# EAGLE schematic diagnostic_tool (EAGLE 6.6.0)
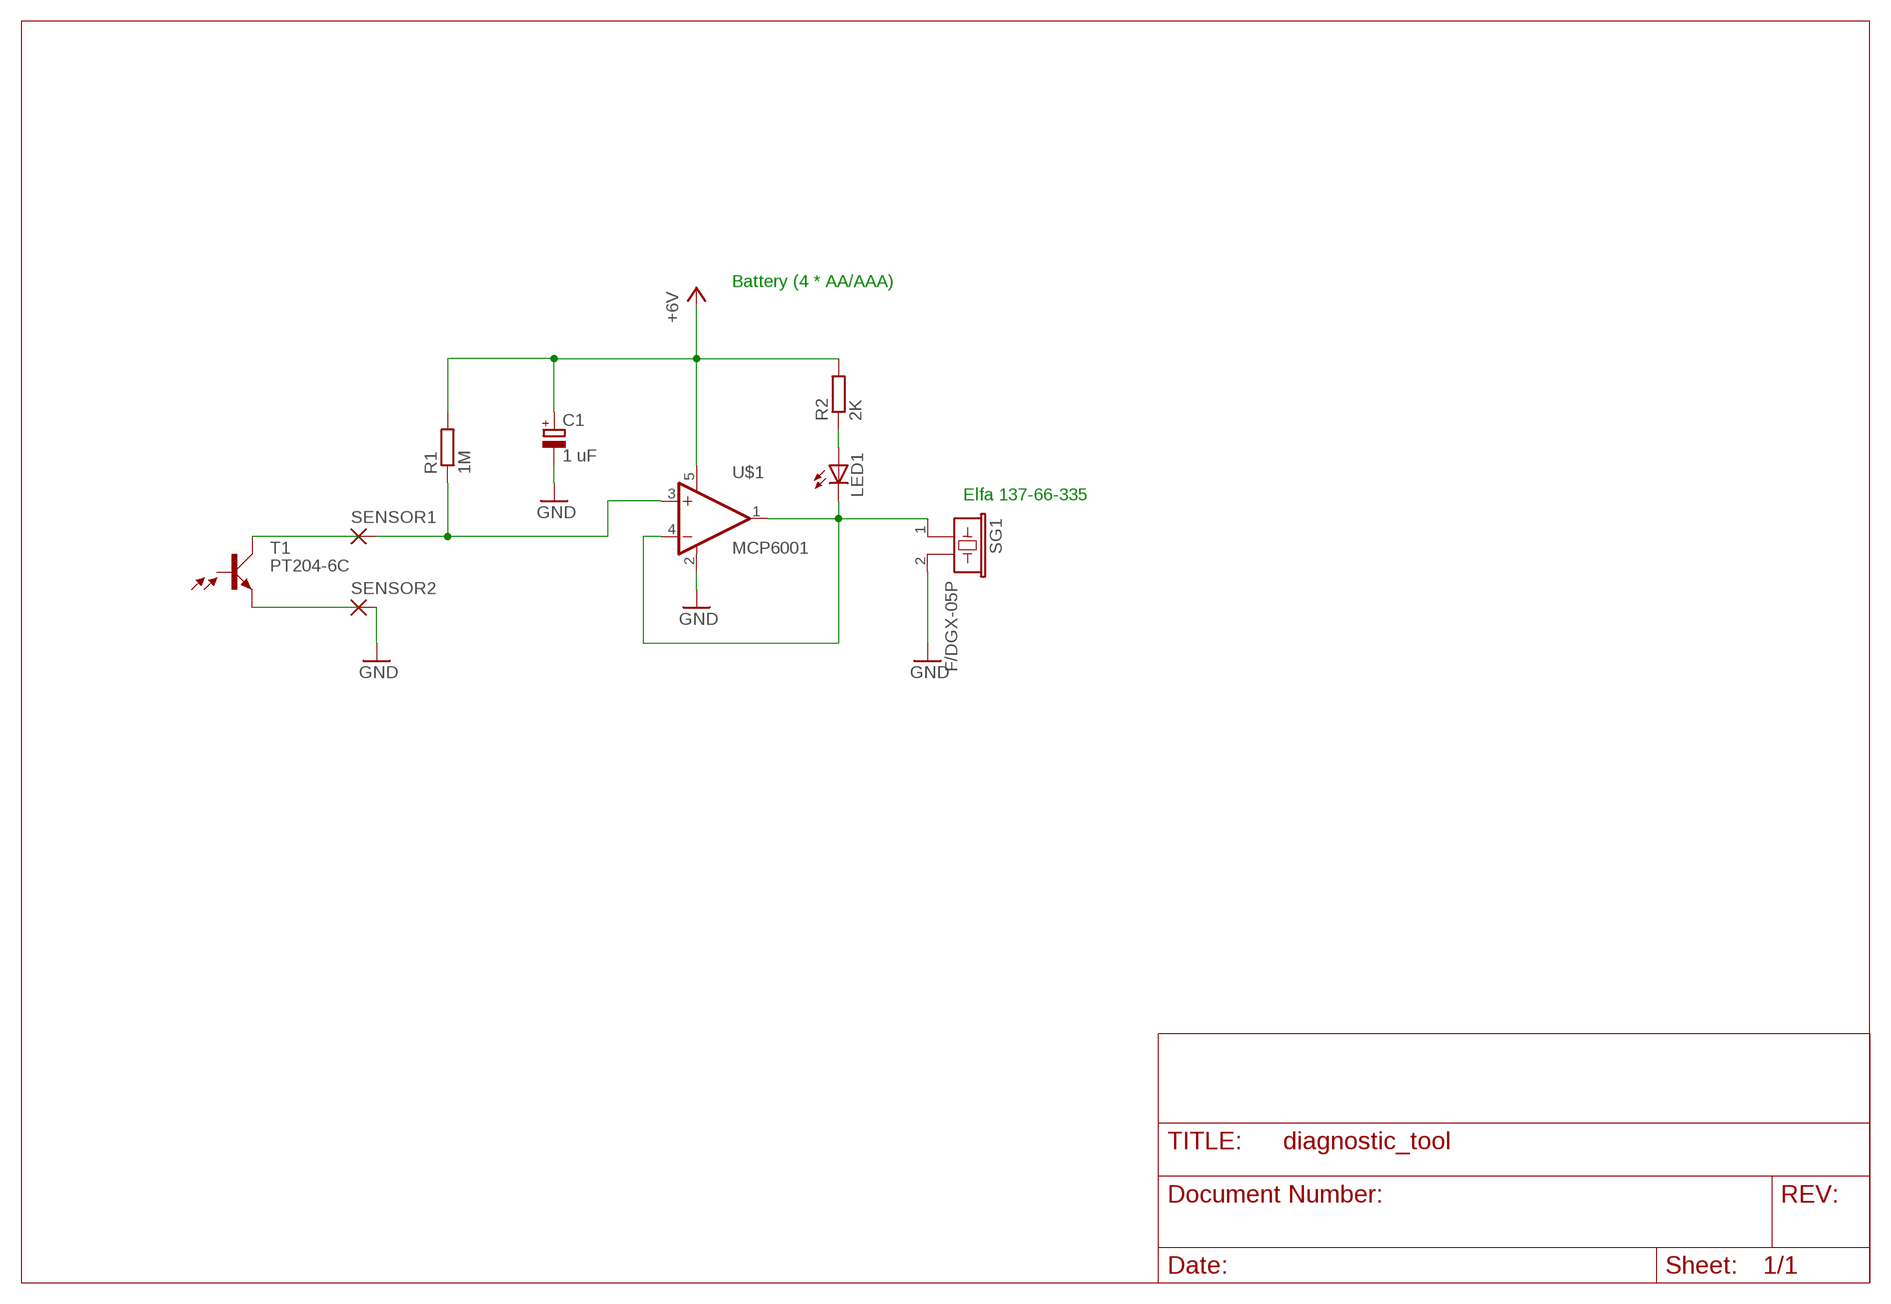
[diagram p0: schematic, sheet 1]

## Parts
C1  1 uF  CPOL-EUE2.5-5  [E2,5-5]
LED1  LED  [SMARTLED-TTW]
R1  1M  R-EU_0207/10  [0207/10]
R2  2K  R-EU_0207/10  [0207/10]
SENSOR1  WIREPAD1,6/0,8  [1,6/0,8]
SENSOR2  WIREPAD1,6/0,8  [1,6/0,8]
SG1  F/DGX-05P  B/C11L  [B/C11L]
T1  PT204-6C  BP103  [BP103]
U$1  MCP6001  [SOT23-5L]

## Nets
+5V: C1.+ R1.2 R2.2 U$1.5(V+) ; supply symbol labelled +6V
GND: C1.- SENSOR2.1(P) SG1.2 U$1.2(V-)
N$1: T1.C
N$2: LED1.A@1(A) R2.1
N$3: LED1.C@1(C) SG1.1 U$1.1(OUT) U$1.4(-IN)
N$4: T1.E
N$5: R1.1 SENSOR1.1(P) U$1.3(+IN)
Unconnected: T1.B

## Notes on the sheet
- Battery (4 * AA/AAA)
- Elfa 137-66-335

## Library data of the parts
C1 = rcl:CPOL-EU: POLARIZED CAPACITOR, European symbol
LED1 = led:LED: LED OSRAM: - CHIPLED LG R971, LG N971, LY N971, LG Q971, LY Q971, LO R971, LY R971 LH N974, LH R974 LS Q976, LO Q976, LY Q976 LO Q996 - Hyper CHIPLED LW Q18S LB Q993, LB Q99A, LB R99A - SideLED LS A670, LO A670, LY A670, LG A670, LP A670 LB A673, LV A673, LT A673, LW A673 LH A674 LY A675 LS A676, LA A676, LO A676, LY A676, LW A676 LS A679, LY A679, LG A679 - Hyper Micro SIDELED® LS Y876, LA Y876, LO Y876, LY Y876 LT Y87S - SmartLED LW L88C, LW L88S LB L89C, LB L89S, LG L890 LS L89K, LO L89K, LY L89K LS L896, LA L896, LO L896, LY L896 - TOPLED LS T670, LO T670, LY T670, LG T670, LP T670 LSG T670, LSP T670, LSY T670, LOP T670, LYG T670 LG T671, LOG T671, LSG T671 LB T673, LV T673, LT T673, LW T673 LH T674 LS T676, LA T676, LO T676, LY T676, LB T676, LH T676, LSB T676, LW T676 LB T67C, LV T67C, LT T67C, LS T67K, LO T67K, LY T67K, LW E67C LS E67B, LA E67B, LO E67B, LY E67B, LB E67C, LV E67C, LT E67C LW T67C LS T679, LY T679, LG T679 LS T770, LO T770, LY T770, LG T770, LP T770 LB T773, LV T773, LT T773, LW T773 LH T774 LS E675, LA E675, LY E675, LS T675 LS T776, LA T776, LO T776, LY T776, LB T776 LHGB T686 LT T68C, LB T68C - Hyper Mini TOPLED® LB M676 - Mini TOPLED Santana® LG M470 LS M47K, LO M47K, LY M47K Source: http://www.osram.convergy.de LUXEON: - LUMILED® LXK2-PW12-R00, LXK2-PW12-S00, LXK2-PW14-U00, LXK2-PW14-V00 LXK2-PM12-R00, LXK2-PM12-S00, LXK2-PM14-U00 LXK2-PE12-Q00, LXK2-PE12-R00, LXK2-PE12-S00, LXK2-PE14-T00, LXK2-PE14-U00 LXK2-PB12-K00, LXK2-PB12-L00, LXK2-PB12-M00, LXK2-PB14-N00, LXK2-PB14-P00, LXK2-PB14-Q00 LXK2-PR12-L00, LXK2-PR12-M00, LXK2-PR14-Q00, LXK2-PR14-R00 LXK2-PD12-Q00, LXK2-PD12-R00, LXK2-PD12-S00 LXK2-PH12-R00, LXK2-PH12-S00 LXK2-PL12-P00, LXK2-PL12-Q00, LXK2-PL12-R00 Source: www.luxeon.com KINGBRIGHT: KA-3528ASYC Source: www.kingbright.com
R1 R2 = rcl:R-EU_: RESISTOR, European symbol
SENSOR1 SENSOR2 = wirepad:WIREPAD: Wire PAD connect wire on PCB
SG1 = buzzer:B/C11L: BUZZER Source: Buerklin; OC_FARNELL: unknown; OC_NEWARK: unknown
T1 = opto-trans-siemens:BP103: PHOTO TRANSISTOR; OC_FARNELL: unknown; OC_NEWARK: unknown
U$1 = eurosource_microchip_opamp:MCP6001